# Altium schematic sheet Q13FC1350000400.schdoc
size 127 x 101 mm
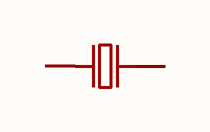
[diagram p0: Q13FC1350000400.schdoc]

## Parts
X?  q13fc13500004_c32346  [FC-135R_L3.2-W1.5]  (value not drawn)

## Nets

Not connected (* = marked no-connect by the designer): X? 1 2

## Library data of the parts
X? = q13fc13500004_c32346: 晶振类型:贴片晶振;频率:32.768kHz;常温频差:±20ppm;负载电容:12.5pF;; Manufacturer: EPSON(爱普生); Symbol: Q13FC1350000400; AddInBom: yes; ModelId: 751105e878f044059ef0ee72de95f96e; ModelTransform: 125.984,59.055,0,0,0,0,0,0,0; Normal temperature Frequency Tolerance: ±20ppm; Load Capacitance: 12.5pF; Equivalent Series Resistance(ESR): 70kΩ; LCSC Part Name: 32.768kHz ±20ppm 12.5pF; SupplierPart: C32346; ManufacturerPart: Q13FC13500004; Supplier Footprint: SMD3215-2P; JLCPCB Part Class: Basic Part; Datasheet: https://item.szlcsc.com/datasheet/Q13FC13500004/33310.html; Supplier: LCSC; ConvertToPcb: yes; FootprintName: FC-135R_L3.2-W1.5; ModelName: FC-135R_L3.2-W1.5; Type: 贴片晶振; Value: 32.768kHz; Operating Temperature: -40℃~+85℃